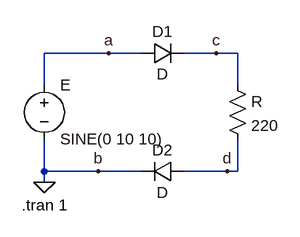
[diagram p0: schematic Draft7.asc]
Draft7.asc, the LTspice schematic file:
Version 4
SHEET 1 880 680
WIRE 160 96 64 96
WIRE 208 96 160 96
WIRE 320 96 272 96
WIRE 352 96 320 96
WIRE 64 144 64 96
WIRE 352 144 352 96
WIRE 64 272 64 224
WIRE 144 272 64 272
WIRE 208 272 144 272
WIRE 336 272 272 272
WIRE 352 272 352 224
WIRE 352 272 336 272
WIRE 64 288 64 272
FLAG 160 96 a
FLAG 320 96 c
FLAG 336 272 d
FLAG 144 272 b
FLAG 64 288 0
SYMBOL voltage 64 128 R0
WINDOW 123 0 0 Left 0
WINDOW 39 0 0 Left 0
SYMATTR InstName E
SYMATTR Value SINE(0 10 10)
SYMBOL diode 208 112 R270
WINDOW 0 32 32 VTop 2
WINDOW 3 0 32 VBottom 2
SYMATTR InstName D1
SYMBOL diode 272 256 R90
WINDOW 0 0 32 VBottom 2
WINDOW 3 32 32 VTop 2
SYMATTR InstName D2
SYMBOL res 336 128 R0
SYMATTR InstName R
SYMATTR Value 220
SYMATTR SpiceLine tol=1 pwr=0.1
TEXT 30 322 Left 2 !.tran 1

The netlist it stands for:
* Draft7.asc
V§E a 0 SINE(0 10 10)
D1 a c D
D2 d 0 D
R c d 220 tol=1 pwr=0.1
.model D D
.lib standard.dio
.tran 1
.backanno
.end

* Results of the author's LTspice run, read from the files saved beside the schematic
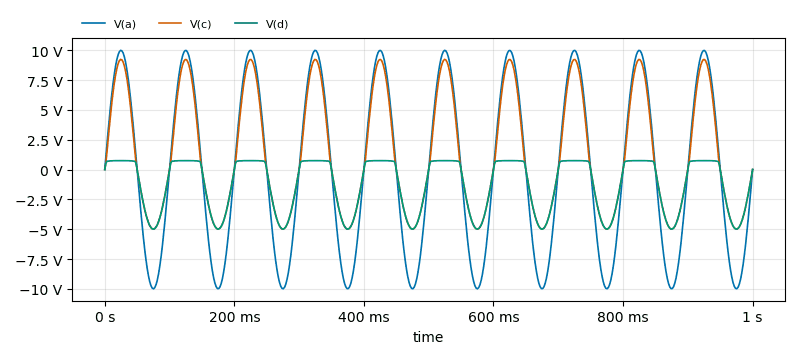
[diagram p1: Transient Analysis of Draft7.asc, plotted from the saved traces]
* Transient Analysis, 1 run:
*   V(a): min -9.999 V, max 9.995 V, average 127.4 µV, rms 7.07 V, last 0 V
*   V(c): min -4.995 V, max 9.236 V, average 1.241 V, rms 5.171 V, last 0 V
*   V(d): min -4.995 V, max 749.6 mV, average -1.241 V, rms 2.547 V, last 0 V